# EAGLE design AmbaSat-03-BME680 (EAGLE 9.5.1)
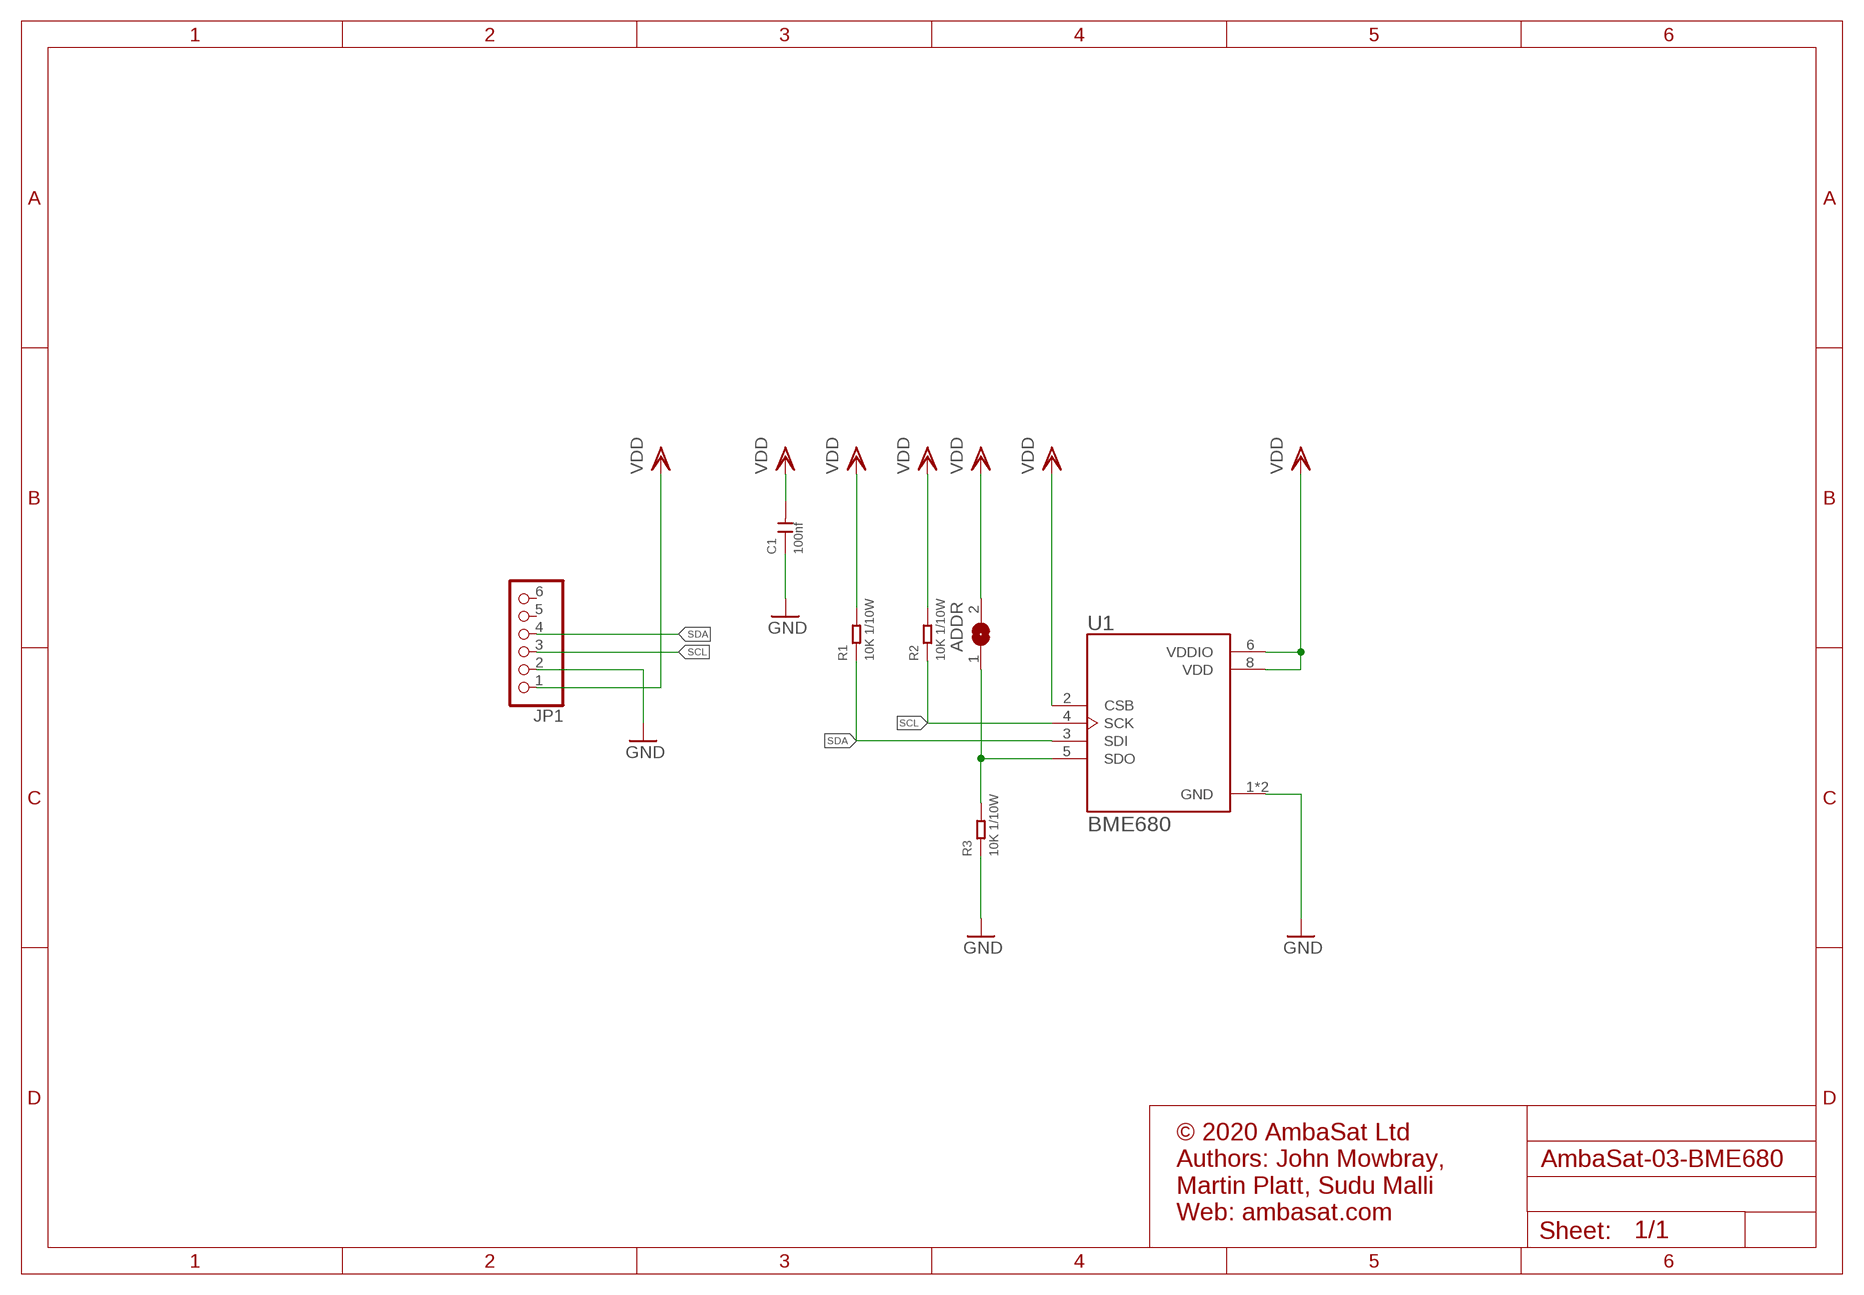
[diagram p0: schematic, sheet 1]

## Parts
ADDR  SJ  [SJ]
C1  100nf  CERAMIC-100NF-50V-10%-X7R(0603)  [C0603]
JP1  HEADER-1X6  [1X06_OVAL]
R1  10K 1/10W  SMD-RES-10K-5%-1/10W(0603)  [R0603]
R2  10K 1/10W  SMD-RES-10K-5%-1/10W(0603)  [R0603]
R3  10K 1/10W  SMD-RES-10K-5%-1/10W(0603)  [R0603]
U1  BME680  [PSON80P300X300X100-8N]

## Nets
GND: C1.1 JP1.2 R3.1 U1.1(GND) U1.7(GND)
N$3: ADDR.1 R3.2 U1.5(SDO)
SCL: JP1.3 R2.1 U1.4(SCK)
SDA: JP1.4 R1.1 U1.3(SDI)
VDD: ADDR.2 C1.2 JP1.1 R1.2 R2.2 U1.2(CSB) U1.6(VDDIO) U1.8(VDD)
Unconnected: JP1.5 JP1.6

## Notes on the sheet
- © 2020 AmbaSat Ltd
  Authors: John Mowbray, 
  Martin Platt, Sudu Malli
  Web: ambasat.com

## Library data of the parts
ADDR = jumper:SJ: SMD solder JUMPER
C1 = Seeed-Capacitor:CERAMIC-100NF-50V-10%-X7R(0603): 302010138; MPN: CC0603KRX7R9BB104
JP1 = microbuilder:HEADER-1X6: PIN HEADER
R1-R3 = Seeed-Resistor:SMD-RES-10K-5%-1/10W(0603): 301010293; MPN: RC0603JR-0710KL
U1 = BME680:BME680: Integrated Environmental Unit; AVAILABILITY: Unavailable; DESCRIPTION: Integrated Environmental Unit; MF: Bosch Sensortec; MP: BME680; PACKAGE: LGA-8 Bosch Tools; PRICE: None

## Board
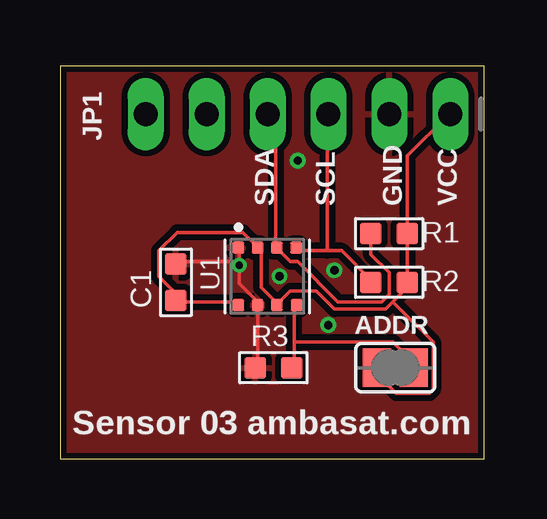
[diagram p1: board, top side]
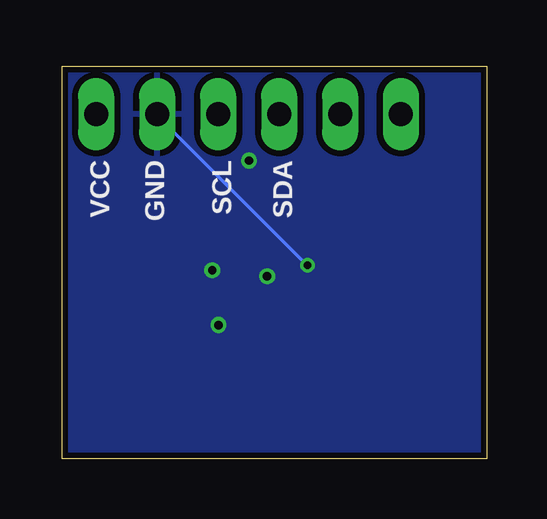
[diagram p2: board, bottom side, seen from below]

Size 17.68 x 16.38 mm. Coordinates in mm from the lower left corner, seen from the top.
Outline: 0,0 17.68,0 17.68,16.38 0,16.38 0,0
Copper layers (1*16): Top 0.035mm / dielectric 1.5mm / Bottom 0.035mm
Design rules "SeeedStudio_2layer_DRU_no_angle_20140221": minimum track width 6mil, minimum drill 12mil, track to track 6mil, track to pad 6mil, pad to pad 6mil, via to via 6mil, smd to smd 0mil, copper to edge 10mil, drill to drill 10mil, minimum pad ring 10mil, minimum via ring 6mil, stop-mask expansion 2mil, vias tented up to drill 100mil, thermal gap 10mil

### Footprints (pad centres in the part's own frame; a part is rotated, then mirrored left to right if it is on the bottom)
SJ = smd 1.168 x 1.6: 1 -0.762,0; 2 0.762,0
C0603 = smd 0.889 x 0.889: 1 0,0.762; 2 0,-0.762
1X06_OVAL = drill 1 long: 1 -6.35,0; 2 -3.81,0; 3 -1.27,0; 4 1.27,0; 5 3.81,0; 6 6.35,0
R0603 = smd 0.889 x 0.889: 1 0,0.762; 2 0,-0.762
PSON80P300X300X100-8N = smd 0.5 x 0.5: 1 1.2,1.2; 2 1.2,0.4; 3 1.2,-0.4; 4 1.2,-1.2; 5 -1.2,-1.22; 6 -1.2,-0.4; 7 -1.2,0.4; 8 -1.2,1.2

### Placement (x,y rotation side)
ADDR  13.97,3.81 180 top
C1  4.83,7.37 0 top
JP1  9.92,14.38 180 top
R1  13.72,9.4 90 top
R2  13.72,7.37 90 top
R3  8.89,3.81 90 top
U1  8.64,7.62 90 top

### Tracks (layer width: path | path; a pad name or v marks a point on that pad's centre or on a via)
GND  (via drill 0.3, 0.35)
  Top 0.152: R3.1 8.23,3.81 8.23,6.4 U1.7 8.23,6.55 7.47,7.32 v7.47,8.08 7.47,8.23 | 7.47,8.23 7.47,8.69 U1.1 | 7.47,8.23 4.88,8.23 C1.1
  Bottom 0.152: v7.47,8.08 13.72,14.33 JP1.2
  other vias: 9.91,12.45 11.43,7.87 11.18,5.59 9.14,7.62
  pour Bottom (isolate 0.254): 0,16.38 0,0 17.68,0 17.68,16.38
  pour Top (isolate 0.254): 0,16.38 0,0 17.68,0 17.68,16.38
N$3
  Top 0.152: 9.75,4.88 9.75,3.81 R3.2 | 9.75,4.88 9.75,6.4 U1.5 | 9.75,4.88 13.87,4.88 14.63,4.12 14.63,3.81 ADDR.1
SCL
  Top 0.152: 11.12,8.69 11.73,8.69 12.95,7.47 R2.1 | 11.12,8.69 9.91,8.69 U1.4 | 11.12,8.69 11.12,14.33 JP1.3
SDA
  Top 0.152: JP1.4 8.69,14.33 8.99,14.02 8.99,8.84 U1.3 9.14,8.69 9.6,8.23 9.91,8.23 11.58,6.55 13.41,6.55 13.72,6.86 13.72,7.77 12.95,8.53 R1.1
VDD
  Top 0.152: U1.8 7.32,6.55 4.88,6.55 C1.2 4.72,6.71 4.72,7.01 4.12,7.62 4.12,8.69 4.88,9.45 7.62,9.45 8.23,8.84 U1.2 8.38,8.69 8.38,7.16 8.99,6.55 U1.6 9.14,6.55 9.6,7.01 10.67,7.01 11.43,6.25 13.56,6.25 13.87,6.55 | JP1.1 16.15,14.33 14.48,12.65 R1.2 R2.2 14.48,7.16 13.87,6.55 | 13.87,6.55 15.54,4.88 15.54,2.9 15.39,2.74 14.02,2.74 13.26,3.5 13.26,3.81 ADDR.2

### Text on the board
tPlace: SDA | SCL | GND | VCC | Sensor 03 ambasat.com
bPlace: SDA | SCL | GND | VCC